# EAGLE design SmallTime-v02 (EAGLE 6.3)
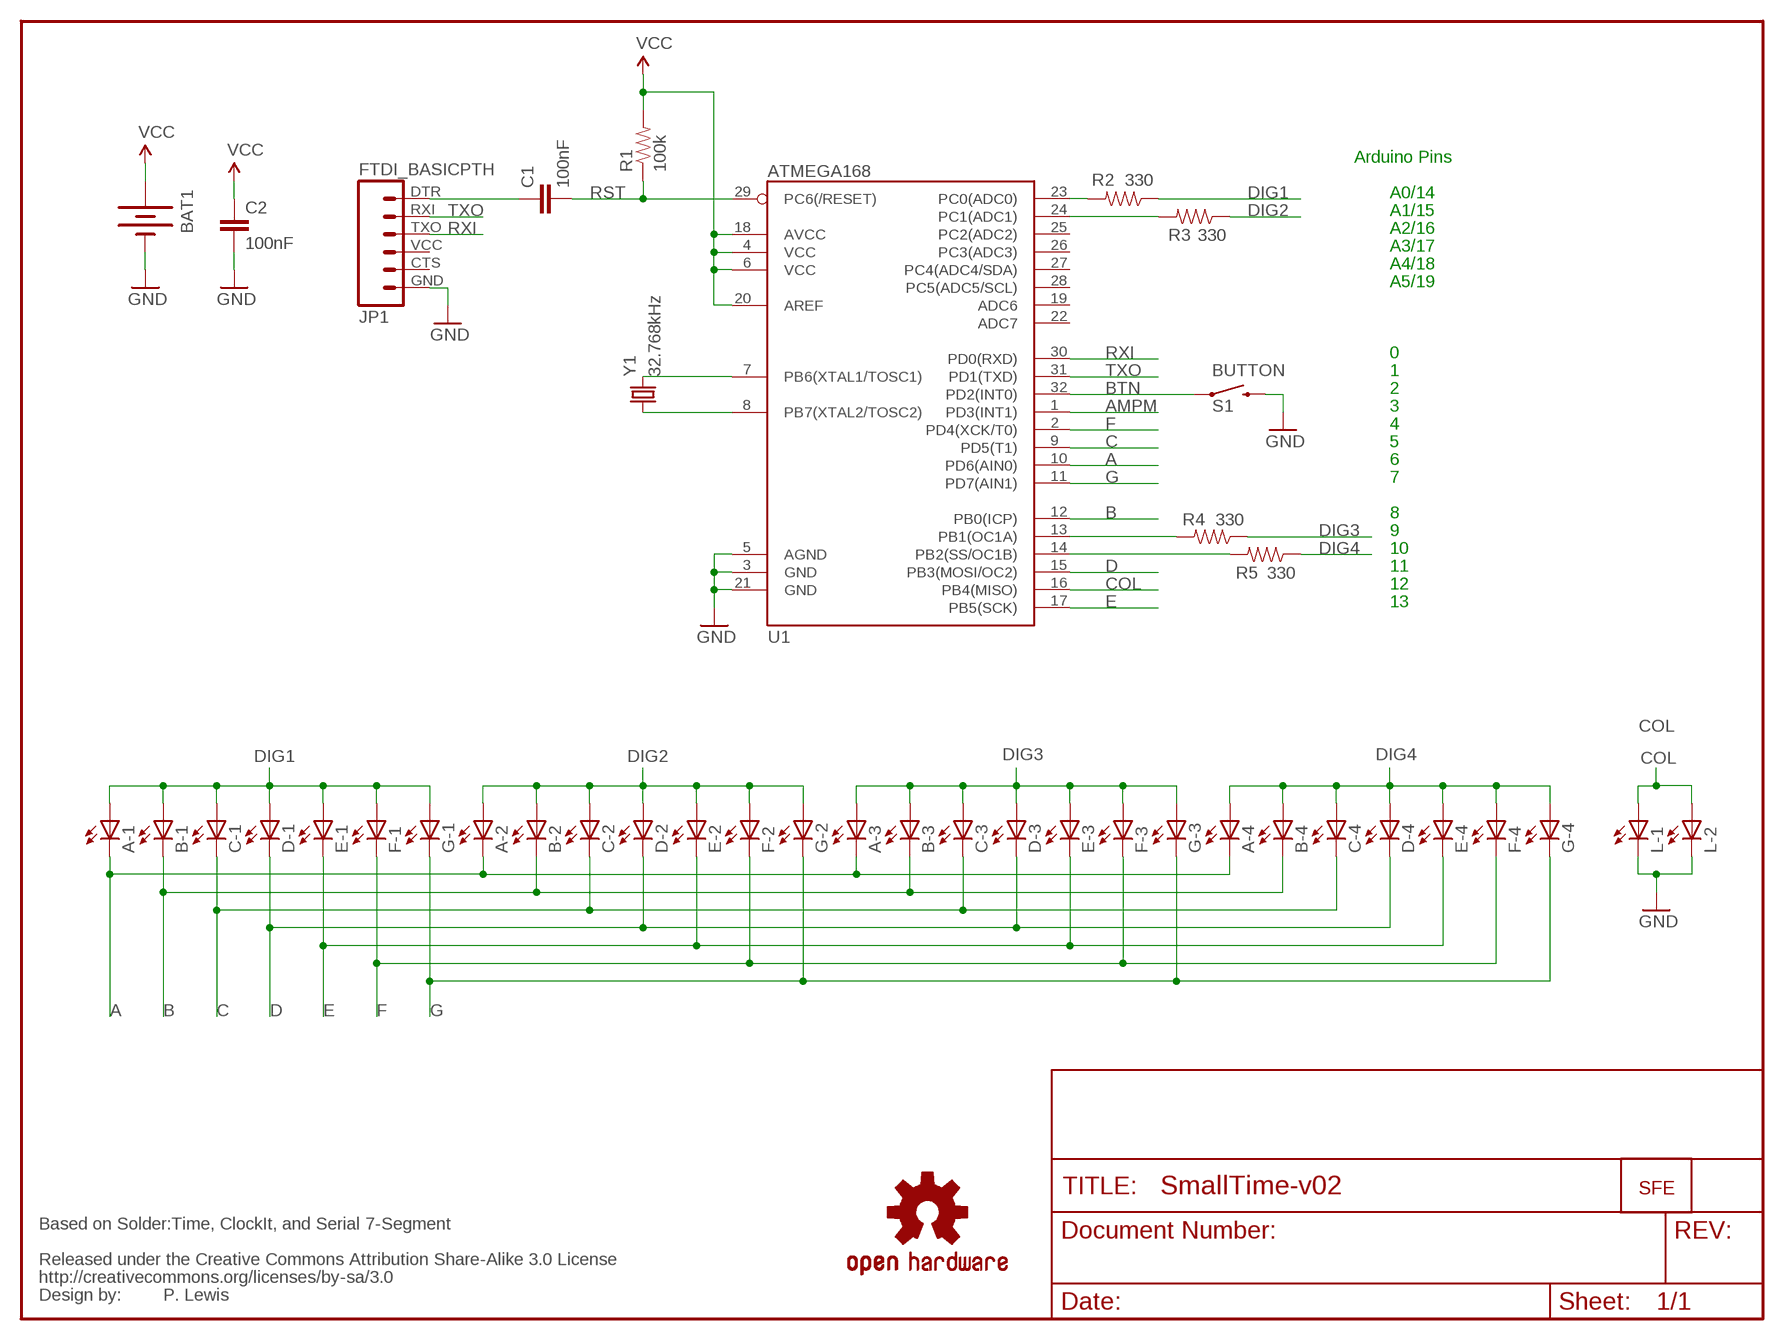
[diagram p0: schematic, sheet 1]

## Parts
A-1  LEDBOTTOM  [LED-1206-BOTTOM-TINGHT]
A-2  LEDBOTTOM  [LED-1206-BOTTOM-TINGHT]
A-3  LEDBOTTOM  [LED-1206-BOTTOM-TINGHT]
A-4  LEDBOTTOM  [LED-1206-BOTTOM-TINGHT]
B-1  LEDBOTTOM  [LED-1206-BOTTOM-TINGHT]
B-2  LEDBOTTOM  [LED-1206-BOTTOM-TINGHT]
B-3  LEDBOTTOM  [LED-1206-BOTTOM-TINGHT]
B-4  LEDBOTTOM  [LED-1206-BOTTOM-TINGHT]
BAT1  BATTERYFOB  [BATTERY_20MM_PTH_COMPACT]
C1  100nF  CAP0603-CAP  [0603-CAP]
C2  100nF  CAP0603-CAP  [0603-CAP]
C-1  LEDBOTTOM  [LED-1206-BOTTOM-TINGHT]
C-2  LEDBOTTOM  [LED-1206-BOTTOM-TINGHT]
C-3  LEDBOTTOM  [LED-1206-BOTTOM-TINGHT]
C-4  LEDBOTTOM  [LED-1206-BOTTOM-TINGHT]
D-1  LEDBOTTOM  [LED-1206-BOTTOM-TINGHT]
D-2  LEDBOTTOM  [LED-1206-BOTTOM-TINGHT]
D-3  LEDBOTTOM  [LED-1206-BOTTOM-TINGHT]
D-4  LEDBOTTOM  [LED-1206-BOTTOM-TINGHT]
E-1  LEDBOTTOM  [LED-1206-BOTTOM-TINGHT]
E-2  LEDBOTTOM  [LED-1206-BOTTOM-TINGHT]
E-3  LEDBOTTOM  [LED-1206-BOTTOM-TINGHT]
E-4  LEDBOTTOM  [LED-1206-BOTTOM-TINGHT]
F-1  LEDBOTTOM  [LED-1206-BOTTOM-TINGHT]
F-2  LEDBOTTOM  [LED-1206-BOTTOM-TINGHT]
F-3  LEDBOTTOM  [LED-1206-BOTTOM-TINGHT]
F-4  LEDBOTTOM  [LED-1206-BOTTOM-TINGHT]
G-1  LEDBOTTOM  [LED-1206-BOTTOM-TINGHT]
G-2  LEDBOTTOM  [LED-1206-BOTTOM-TINGHT]
G-3  LEDBOTTOM  [LED-1206-BOTTOM-TINGHT]
G-4  LEDBOTTOM  [LED-1206-BOTTOM-TINGHT]
JP1  FTDI_BASICPTH  [FTDI_BASIC]
L-1  LEDBOTTOM  [LED-1206-BOTTOM-TINGHT]
L-2  LEDBOTTOM  [LED-1206-BOTTOM-TINGHT]
R1  100k  RESISTOR0603-RES  [0603-RES]
R2  330  RESISTOR0603-RES  [0603-RES]
R3  330  RESISTOR0603-RES  [0603-RES]
R4  330  RESISTOR0603-RES  [0603-RES]
R5  330  RESISTOR0603-RES  [0603-RES]
S1  BUTTON  SWITCH-MOMENTARY-2SIDE_EZ  [TACTILE-PTH-SIDEEZ]
U1  ATMEGA168  [TQFP32-08]
U$2  CREATIVE_COMMONS  [CREATIVE_COMMONS]
U$4  OSHW-LOGOS  [OSHW-LOGO-S]
U$5  LOGO-SFENW2  [SFE-NEW-WEB]
Y1  32.768kHz  CRYSTALTC26H_EZ  [TC26HEZ]

## Nets
A: A-1.C A-2.C A-3.C A-4.C U1.10(PD6(AIN0))
AMPM: U1.1(PD3(INT1))
B: B-1.C B-2.C B-3.C B-4.C U1.12(PB0(ICP))
BTN: S1.1 U1.32(PD2(INT0))
C: C-1.C C-2.C C-3.C C-4.C U1.9(PD5(T1))
COL: L-1.A L-2.A U1.16(PB4(MISO))
D: D-1.C D-2.C D-3.C D-4.C U1.15(PB3(MOSI/OC2))
DIG1: A-1.A B-1.A C-1.A D-1.A E-1.A F-1.A G-1.A R2.1
DIG2: A-2.A B-2.A C-2.A D-2.A E-2.A F-2.A G-2.A R3.1
DIG3: A-3.A B-3.A C-3.A D-3.A E-3.A F-3.A G-3.A R4.1
DIG4: A-4.A B-4.A C-4.A D-4.A E-4.A F-4.A G-4.A R5.1
E: E-1.C E-2.C E-3.C E-4.C U1.17(PB5(SCK))
F: F-1.C F-2.C F-3.C F-4.C U1.2(PD4(XCK/T0))
G: G-1.C G-2.C G-3.C G-4.C U1.11(PD7(AIN1))
GND: BAT1.2(-) C2.2 JP1.GND L-1.C L-2.C S1.2 U1.3(GND) U1.5(AGND) U1.21(GND)
N$1: U1.8(PB7(XTAL2/TOSC2)) Y1.1
N$2: U1.7(PB6(XTAL1/TOSC1)) Y1.2
N$3: C1.1 JP1.DTR
N$4: R4.2 U1.13(PB1(OC1A))
N$5: R5.2 U1.14(PB2(SS/OC1B))
N$6: R3.2 U1.24(PC1(ADC1))
N$7: R2.2 U1.23(PC0(ADC0))
RST: C1.2 R1.1 U1.29(PC6(/RESET))
RXI: JP1.TXO U1.30(PD0(RXD))
TXO: JP1.RXI U1.31(PD1(TXD))
VCC: BAT1.1(+) C2.1 R1.2 U1.4(VCC) U1.6(VCC) U1.18(AVCC) U1.20(AREF)
Unconnected: JP1.CTS JP1.VCC U1.19(ADC6) U1.22(ADC7) U1.25(PC2(ADC2)) U1.26(PC3(ADC3)) U1.27(PC4(ADC4/SDA)) U1.28(PC5(ADC5/SCL))

## Notes on the sheet
- Arduino Pins
- A0/14
- A1/15
- A2/16
- A3/17
- A4/18
- A5/19
- 0
- 1
- 2
- 3
- 4
- 5
- 6
- 7
- 8
- 9
- 10
- 11
- 12
- 13
- COL
- Based on Solder:Time, ClockIt, and Serial 7-Segment
- P. Lewis

## Library data of the parts
A-1-A-4 B-1-B-4 C-1-C-4 D-1-D-4 E-1-E-4 F-1-F-4 G-1-G-4 L-1 L-2 = Testing:LED: LEDs Standard schematic elements and footprints for 5mm, 3mm, 1206, and 0603 sized LEDs. 5mm - Spark Fun Electronics SKU : COM-00529 (and others)
BAT1 = SparkFun:BATTERY: Battery Holders Various common sizes : AA, AAA, 20mm coin cell and 12mm coin cell.
C1 C2 = SparkFun-Passives:CAP: Capacitor Standard 0603 ceramic capacitor, and 0.1" leaded capacitor.
JP1 = SparkFun:FTDI_BASIC: FTDI Basic: 3.3V and 5V
R1-R5 = SparkFun-Passives:RESISTOR: Resistor Basic schematic elements and footprints for 0603, 1206, and PTH resistors.
S1 = SparkFun-Electromechanical:SWITCH-MOMENTARY-2: Various NO switches- pushbuttons, reed, etc
U1 = SparkFun:ATMEGA168
U$2 = SparkFun:CREATIVE_COMMONS
U$4 = SparkFun:OSHW-LOGO: Open Source Hardware Logo This logo indicates the piece of hardware it is found on incorporates a OSHW license and/or adheres to the definition of open source hardware found here: http://freedomdefined.org/OSHW
U$5 = SparkFun:LOGO-SFE: Spark Fun Electronics PCB Logo This is the standard Spark Fun Electronics PCB logo.
Y1 = SparkFun-FreqCtrl:CRYSTAL: Various standard crystals. Proven footprints. Spark Fun Electronics SKU : COM-00534

## Board
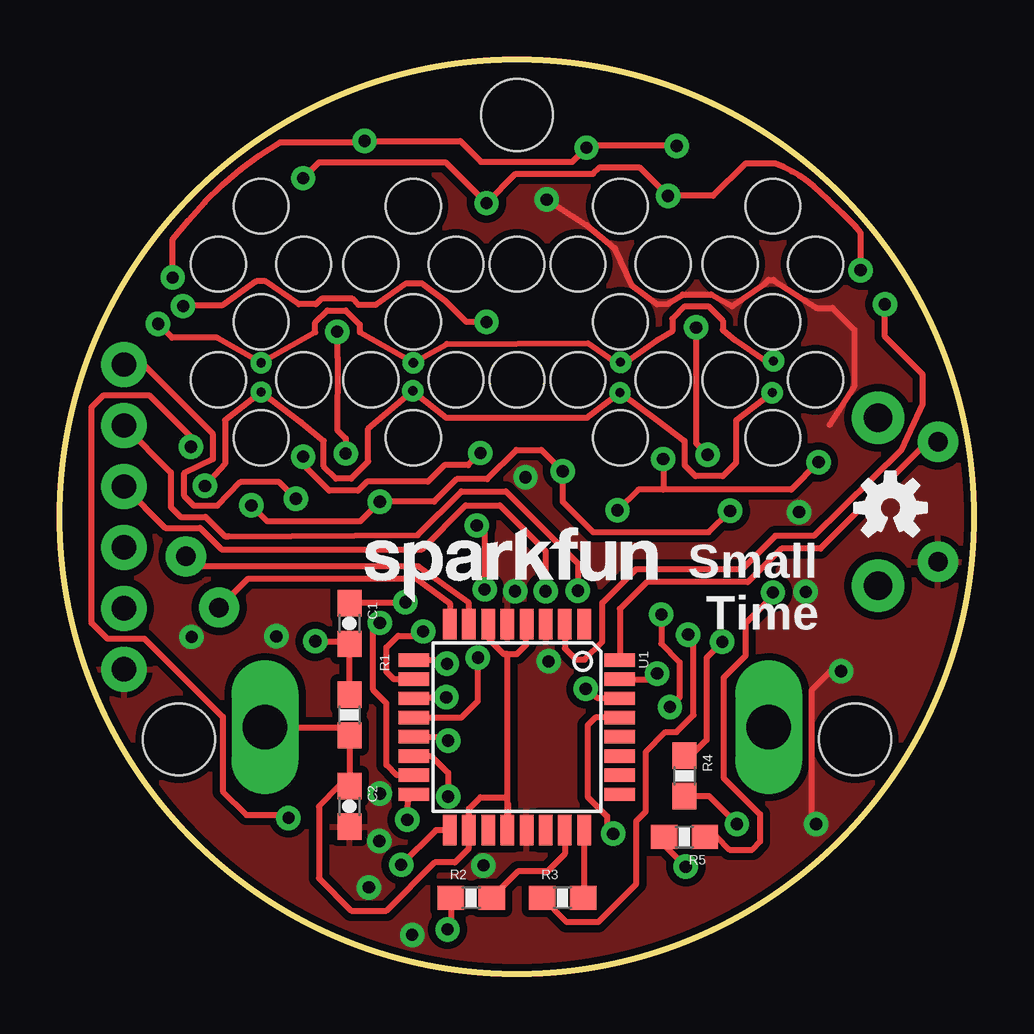
[diagram p1: board, top side]
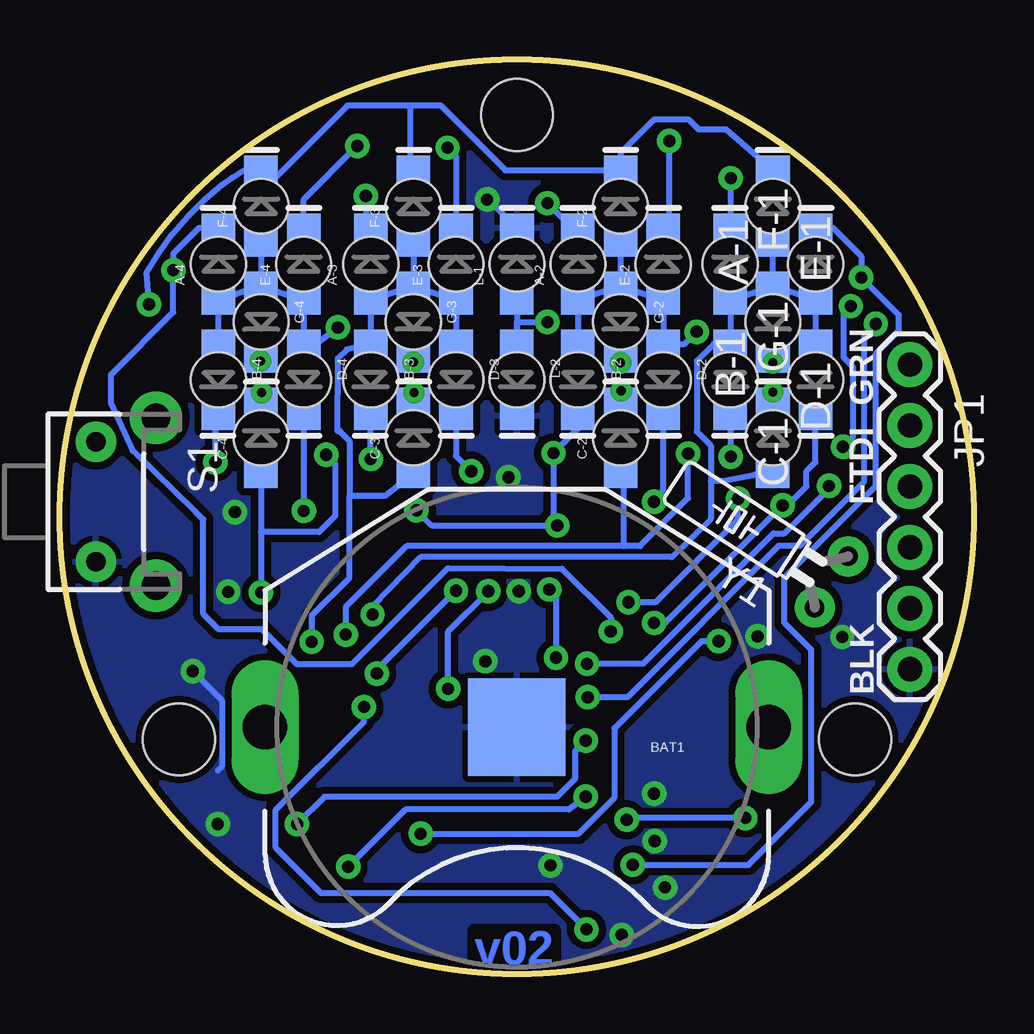
[diagram p2: board, bottom side, seen from below]

Size 38.1 x 38.1 mm. Coordinates in mm from the lower left corner, seen from the top.
Outline: circle at 19.05,19.05 radius 19.05
Copper layers (1*16): Top 0.035mm / dielectric 1.5mm / Bottom 0.035mm
Design rules "SparkFun": minimum track width 8mil, minimum drill 20mil, track to track 8mil, track to pad 8mil, pad to pad 8mil, via to via 8mil, smd to smd 8mil, copper to edge 8mil, drill to drill 8mil, minimum pad ring 12mil, minimum via ring 10mil, stop-mask expansion 4mil, vias tented up to drill 20mil, thermal gap 10mil
Holes 3 mm at 19.05,35.81 4.95,9.78 33.15,9.78

### Footprints (pad centres in the part's own frame; a part is rotated, then mirrored left to right if it is on the bottom)
LED-1206-BOTTOM-TINGHT = smd 1.2 x 1.397: A -1.5,0 | smd 1.2 x 1.4: C 1.5,0 | hole 2.286: 0,0
BATTERY_20MM_PTH_COMPACT = drill 1.854 long: 1 -10.5,0; 3 10.5,0 | smd 4.064 x 4.064: 2 0,0
0603-CAP = smd 1.1 x 1: 1 -0.85,0; 2 0.85,0
FTDI_BASIC = drill 1.016 pad 1.88: CTS 10.16,0; DTR 0,0; GND 12.7,0; RXI 2.54,0; TXO 5.08,0; VCC 7.62,0
0603-RES = smd 1.1 x 1: 1 -0.85,0; 2 0.85,0
TACTILE-PTH-SIDEEZ = drill 0.8 pad 1.7: 1 -2.5,0; 2 2.5,0 | drill 1.2 pad 2.2: ANCHOR1 -3.5,2.5; ANCHOR2 3.5,2.5
TQFP32-08 = smd 1.27 x 0.559: 1 -4.293,2.8; 2 -4.293,2; 3 -4.293,1.2; 4 -4.293,0.4; 5 -4.293,-0.4; 6 -4.293,-1.2; 7 -4.293,-2; 8 -4.293,-2.8; 17 4.293,-2.8; 18 4.293,-2; 19 4.293,-1.2; 20 4.293,-0.4; 21 4.293,0.4; 22 4.293,1.2; 23 4.293,2; 24 4.293,2.8 | smd 0.559 x 1.27: 9 -2.8,-4.293; 10 -2,-4.293; 11 -1.2,-4.293; 12 -0.4,-4.293; 13 0.4,-4.293; 14 1.2,-4.293; 15 2,-4.293; 16 2.8,-4.293; 25 2.8,4.293; 26 2,4.293; 27 1.2,4.293; 28 0.4,4.293; 29 -0.4,4.293; 30 -1.2,4.293; 31 -2,4.293; 32 -2.8,4.293
TC26HEZ = drill 0.813 pad 1.676: 1 -1.27,0; 2 1.27,0

### Placement (x,y rotation side)
A-1  10.16,29.59 90 bottom
A-2  16.51,29.59 90 bottom
A-3  25.15,29.59 90 bottom
A-4  31.5,29.59 90 bottom
B-1  10.16,24.77 270 bottom
B-2  16.51,24.77 270 bottom
B-3  25.15,24.77 270 bottom
B-4  31.5,24.77 270 bottom
BAT1  19.05,10.29 180 bottom
C1  12.07,14.61 270 top
C2  12.07,6.99 270 top
C-1  8.38,22.35 90 bottom
C-2  14.73,22.35 90 bottom
C-3  23.37,22.35 90 bottom
C-4  29.72,22.35 90 bottom
D-1  6.6,24.77 270 bottom
D-2  12.95,24.77 270 bottom
D-3  21.59,24.77 270 bottom
D-4  27.94,24.77 270 bottom
E-1  6.6,29.59 90 bottom
E-2  12.95,29.59 90 bottom
E-3  21.59,29.59 90 bottom
E-4  27.94,29.59 90 bottom
F-1  8.38,32 90 bottom
F-2  14.73,32 90 bottom
F-3  23.37,32 90 bottom
F-4  29.72,32 90 bottom
G-1  8.38,27.18 270 bottom
G-2  14.73,27.18 270 bottom
G-3  23.37,27.18 270 bottom
G-4  29.72,27.18 270 bottom
JP1  2.67,25.4 270 bottom
L-1  19.05,29.59 90 bottom
L-2  19.05,24.77 270 bottom
R1  12.07,10.8 270 top
R2  17.15,3.18 0 top
R3  20.96,3.18 0 top
R4  26.04,8.26 270 top
R5  26.04,5.72 180 top
S1  36.6,19.68 270 bottom
U1  19.05,10.29 270 top
U$2  -3.17,-9.52 0 top  (outside the outline)
U$4  34.62,19.43 0 top
U$5  12.7,15.49 0 top
Y1  5.94,16.34 57 bottom

### Tracks (layer width: path | path; a pad name or v marks a point on that pad's centre or on a via)
A  (via drill 0.51)
  Top 0.254: v15.14,14.28 14.96,14.1 14.1,14.1 13.61,13.61 13.61,12.6 13.93,12.29 U1.10 | v10.14,33.17 10.8,33.83 16.08,33.83 v17.78,32.13 19,33.35 22.23,33.35 22.5,33.63 24.16,33.63 v25.35,32.44 27.23,32.44 28.58,33.78 29.82,33.78 arc-19 31.45,32.82 arc-6 33.15,31.17 33.38,30.89 v33.38,29.34
  Bottom 0.254: v25.35,32.44 25.35,31.29 A-3.C | A-1.C 10.16,31.24 10.14,31.27 v10.14,33.17 | A-4.C 32.31,31.09 33.38,30.03 v33.38,29.34 33.38,27.58 35.97,24.99 35.97,23.77 35.08,21.82 32.46,19.28 32.13,18.95 32.13,15.01 31.5,14.38 29.69,14.38 28.22,12.9 25.93,12.9 21.92,16.92 17.17,16.89 15.14,14.86 v15.14,14.28 | A-2.C 16.74,31.09 v17.78,32.13
B  (via drill 0.51)
  Top 0.254: v31.62,21.34 30.48,20.19 25.15,20.19 | v17.53,21.72 17.02,21.21 16.03,21.21 15.34,20.52 12.8,20.52 12.42,20.14 11.23,20.14 10.14,21.23 v10.14,21.57 | U1.12 16.73,10.69 17.42,11.38 v17.42,13.18 | v17.37,18.69 17.7,18.36 v17.7,16.03 | v25.15,21.46 25.15,20.19 | 25.15,20.19 24.11,20.19 v23.24,19.33
  Bottom 0.254: B-4.C 31.62,23.14 v31.62,21.34 | v25.15,21.46 B-3.C | B-1.C 10.16,21.46 10.14,21.49 v10.14,21.57 | B-2.C 16.51,22.73 v17.53,21.72 17.53,18.85 v17.37,18.69 22.61,18.69 v23.24,19.33 | v17.7,16.03 17.42,15.75 v17.42,13.18
BTN
  Top 0.254: U1.32 23.34,15.22 24.46,16.33 28.68,16.33 30.07,17.73 31.7,17.73 36.15,22.18 S1.1
C  (via drill 0.38, 0.51)
  Top 0.254: v29.69,24.23 28.19,23.09 28.19,21.31 27.64,20.75 26.49,20.75 26.04,21.21 26.04,22.23 24.89,23.09 v23.34,24.23 21.97,23.19 16.1,23.19 v14.71,24.31 12.85,22.73 12.85,21.36 12.14,20.65 11.51,20.65 11,21.16 11,22.23 10.06,22.99 v8.38,24.26 6.88,23.09 6.88,21.26 v6.05,20.35 | U1.9 15.97,13.09 v16.13,12.93
  Bottom 0.254: C-1.C v8.38,24.26 | v14.71,24.31 C-2.C | v29.69,24.23 C-4.C | v23.34,24.23 C-3.C | v16.13,12.93 13.79,12.93 8.36,18.36 7.9,18.36 6.05,20.22 v6.05,20.35
COL  (via drill 0.51)
  Top 0.254: v17.78,27.18 16.94,27.18 16.08,28.04 15.09,28.78 14.43,28.78 13.16,27.89 12.45,27.89 12.19,28.14 10.9,28.14 10.67,27.92 9.96,27.92 8.56,28.88 8.18,28.88 6.76,27.86 5.28,27.86 v5.13,27.84 | v9.53,6.5 9.4,6.63 7.77,6.63 6.78,7.62 6.78,10.72 3.53,13.97 1.98,13.97 1.32,14.63 1.32,23.62 1.83,24.13 3.71,24.13 5.46,22.38 v5.46,21.97 | v14.48,6.43 14.5,7.23 U1.16
  Bottom 0.254: L-1.A L-2.A 19.05,27.18 v17.78,27.18 | v5.13,27.84 5.44,27.71 5.44,25.71 5.06,25.32 5.06,22.38 v5.46,21.97 | v9.53,6.5 14.4,6.5 v14.48,6.43
D  (via drill 0.51)
  Top 0.254: v27.94,19.3 27.05,18.42 22.23,18.42 20.96,19.69 v20.96,20.96 20.07,21.84 19.03,21.84 17.81,20.63 16.54,20.63 15.6,19.69 v13.34,19.69 12.52,18.87 8.64,18.87 v7.98,19.53 | v13.34,14.63 13.06,14.28 13.06,11.84 13.61,11.28 13.61,8.71 14.04,8.29 U1.15
  Bottom 0.254: 6.76,23.27 D-1.C 6.6,21.34 6.99,20.96 6.99,20.32 7.77,19.53 v7.98,19.53 12.88,14.63 v13.34,14.63 | v13.34,19.69 12.95,20.19 D-2.C | D-3.C 21.59,21.59 v20.96,20.96 | D-4.C v27.94,19.3
DIG1  (via drill 0.51)
  Top 0.254: R2.1 16.3,2 v16.15,1.85 | v25.07,14.99 25.07,13.77 25.83,13.01 25.83,11.53 v25.43,11.13
  Bottom 0.254: G-1.A E-1.A D-1.A | G-1.A F-1.A | G-1.A A-1.A B-1.A 10.84,26.27 11.56,25.55 11.56,22.61 10.97,22.02 10.97,20.55 | 8.38,21.11 C-1.A 8.54,21.11 9.12,20.83 10.52,20.55 10.97,20.55 | v25.07,14.99 25.07,15.32 23.06,17.37 12.6,17.37 11.8,18.14 10.97,18.97 10.97,20.55 | v25.43,11.13 25.43,10.52 29.11,6.83 29.11,5.26 27.23,3.38 17.68,3.38 v16.15,1.85
DIG2  (via drill 0.51)
  Top 0.254: v11.91,21.69 11.91,22.33 11.56,22.68 11.58,25.68 11.58,26.75 v11.56,26.77 | R3.1 21.12,2.16 22.43,2.16 24.03,3.76 24.03,6.38 24.41,6.76 24.41,9.25 25.25,10.08 25.71,10.08 26.42,10.8 26.42,13.92 v26.19,14.15
  Bottom 0.254: F-2.A G-2.A | G-2.A E-2.A D-2.A 12.06,26.27 v11.56,26.77 | G-2.A A-2.A B-2.A | 14.78,21.06 C-2.A 14.61,20.98 14.61,17.83 | 14.61,17.83 13.92,17.83 11.91,19.84 v11.91,21.69 | 14.61,17.83 23.65,17.83 26.19,15.29 v26.19,14.15
DIG3  (via drill 0.51)
  Top 0.254: R4.1 26.3,9.11 26.95,9.75 26.95,13.18 v27.61,13.84
  Bottom 0.254: F-3.A G-3.A | G-3.A A-3.A B-3.A 26.14,26.04 26.52,25.65 26.54,22.63 26.44,22.63 26.04,22.23 26.04,19.94 | G-3.A E-3.A D-3.A | 23.42,21.16 C-3.A 24.54,19.94 26.04,19.94 | 26.04,19.94 26.04,16.51 27.61,14.94 v27.61,13.84
DIG4  (via drill 0.51)
  Top 0.254: v26.52,26.95 26.52,22.12 v27,21.64 | R5.1 27.38,5.72 27.92,5.18 28.85,5.18 29.19,5.51 29.19,6.66 27.66,8.18 27.66,12.34 28.58,13.26 28.58,14.61 29.72,15.75 v29.72,15.9
  Bottom 0.254: F-4.A G-4.A | G-4.A A-4.A B-4.A | G-4.A E-4.A 27.94,26.77 27.43,26.27 | D-4.A 27.43,26.27 | 27.43,26.27 v26.52,26.95 | v27,21.64 26.62,21.26 26.62,19.1 27.31,18.42 29.72,18.42 | C-4.A 29.72,18.42 | 29.72,18.42 v29.72,15.9
E  (via drill 0.51)
  Top 0.254: v25.71,34.52 22.02,34.52 v21.95,34.44 21.36,33.86 17.55,33.86 16.69,34.72 v12.7,34.72 12.7,34.67 9.17,34.67 arc19 5.36,31.42 4.7,30.63 v4.7,29.03 | U1.17 15.67,5.99 v14.22,4.55
  Bottom 0.254: E-4.C 27.94,32.28 v25.71,34.52 | v21.95,34.44 21.59,34.09 E-3.C | E-2.C 12.7,31.35 v12.7,34.72 | E-1.C 5.87,31.09 4.7,29.92 v4.7,29.03 3.12,27.46 3.12,26.82 4.09,25.86 4.09,20.35 7.9,16.54 7.9,14.63 6.78,13.51 6.78,7.16 9.4,4.55 v14.22,4.55
F  (via drill 0.51)
  Top 0.254: U1.2 21.05,13.57 21.51,13.11 21.87,13.11 22.61,13.84 22.61,15.47 24,16.87 28.42,16.87 29.82,18.26 31.42,18.26 35.08,21.84 35.97,23.77 35.97,24.99 34.39,26.57 v34.39,27.92
  Bottom 0.254: v34.39,27.92 34.49,29.24 arc22 31.32,32.92 arc7 30.12,33.68 29.95,33.5 F-4.C 29.06,33.25 26.11,36.2 23.5,36.2 | F-3.C 23.5,33.38 23.5,36.2 | 23.5,36.2 22.23,36.2 19.53,33.5 F-2.C 14.73,34.21 13.34,35.61 11.89,35.61 11.48,35.2 10.34,35.2 F-1.C
G  (via drill 0.38, 0.51)
  Top 0.254: v29.74,25.55 29.41,25.55 28.14,26.42 27.64,26.85 27.64,27.23 27.03,27.84 26.06,27.84 25.53,27.31 25.53,26.8 24.92,26.44 23.6,25.5 v23.37,25.5 23.11,25.5 23.09,25.53 22,26.29 16.13,26.26 v14.73,25.48 12.5,26.75 12.5,27.08 11.91,27.66 11.15,27.66 10.64,27.15 10.64,26.75 v8.38,25.48 6.55,26.52 4.67,26.52 v4.09,27.1 | U1.11 14.8,11.53 v16.1,11.53
  Bottom 0.254: G-4.C v29.74,25.55 | G-3.C v23.37,25.5 | v14.73,25.48 G-2.C | v8.38,25.48 G-1.C | v16.1,11.53 14.45,11.53 8.13,17.86 7.24,17.86 4.57,20.52 4.57,26.62 v4.09,27.1
GND  (via drill 0.51)
  Top 0.254: v20.3,32.28 21.95,31.22 23.14,30.23 23.85,28.7 24.89,27.92 25.35,27.94 25.96,28.32 27.15,28.32 28.02,27.84 29.39,28.78 29.54,28.93 29.74,28.93 31.55,27.76 32.21,27.76 33.12,26.85 33.12,24.51 32.08,22.89 | v31.52,6.25 31.34,6.43 31.34,11.84 32.13,12.62 v32.56,12.62
  Bottom 0.254: L-1.C 20.24,32.28 v20.3,32.28 | v32.56,12.62 31.34,11.41 31.34,8.66 31.52,8.48
  other vias: 19.41,20.7 31.09,15.93 13.31,5.54 9.02,14.07 5.49,14.05 30.81,19.25 20.37,13.03 12.88,3.61 17.65,4.52 13.34,7.52 18.97,15.95 14.68,1.63
  pour Bottom (isolate 0.305): -0.63,-0.63 -0.63,38.73 38.73,38.73 38.73,-0.63
  pour Top (isolate 0.305): -0.63,-0.63 -0.63,38.73 38.73,38.73 38.73,-0.63
N$1
  Top 0.254: U1.8 16.25,15.45 14.83,16.49 7.84,16.49 Y1.1
N$2
  Top 0.254: U1.7 17.05,15.46 14.94,16.99 5.66,16.99 Y1.2
N$3  (via drill 0.51)
  Top 0.254: JP1.DTR 3.48,25.4 6.38,22.5 6.38,21.46 5.18,20.88 5.18,19.91 5.59,19.51 6.55,19.51 7.52,20.5 9.14,20.5 v9.83,19.81 | C1.1 12.1,15.49 v14.4,15.49
  Bottom 0.254: v14.4,15.49 13.28,15.49 9.83,18.95 v9.83,19.81
N$4  (via drill 0.51)
  Top 0.254: 14.78,9.91 U1.13 16.02,9.89 v16.18,9.73 | v28.22,6.25 27.06,7.41 R4.2
  Bottom 0.254: v28.22,6.25 27.08,7.39 17.37,7.39 16.61,8.15 16.61,9.3 v16.18,9.73
N$5  (via drill 0.51)
  Top 0.254: U1.14 15.48,9.09 16.18,8.38 v16.18,7.39 | R5.2 25.19,5.37 v26.09,4.47
  Bottom 0.254: v16.18,7.39 16.89,6.86 23.7,6.86 v26.09,4.47
N$6
  Top 0.254: U1.24 21.85,3.22 R3.2
N$7
  Top 0.254: U1.23 21.05,5 20.32,4.27 19.09,4.27 R2.2
RST  (via drill 0.51)
  Top 0.254: R1.1 C1.2 11.95,13.87 v10.64,13.87 | U1.29 22.32,10.69 22,10.36 22,7.39 22.81,6.58 22.81,6.1 v23.06,5.84
  Bottom 0.254: v23.06,5.84 16.49,5.84 14.99,7.34 14.99,10.24 11.35,13.87 v10.64,13.87
RXI  (via drill 0.51)
  Top 0.254: JP1.TXO 4.39,18.59 5.84,18.59 6.73,17.7 15.09,17.7 16.92,19.53 18.34,19.53 20.24,17.63 v20.24,15.95 | U1.30 22.42,11.49 v21.92,11.89
  Bottom 0.254: v21.92,11.89 21.92,14.28 v20.24,15.95
TXO  (via drill 0.51)
  Top 0.254: JP1.RXI 4.62,20.9 4.62,19.46 5.03,19.05 6.07,19.05 6.88,18.24 6.99,18.24 7.04,18.24 14.91,18.29 16.74,20.12 18.59,20.12 21.59,17.12 v21.59,15.98 | U1.31 24.66,12.29 v24.89,12.52
  Bottom 0.254: v21.59,15.98 24.89,12.68 v24.89,12.52
VCC
  Top 0.254: BAT1.1 11.72,10.29 R1.2 C2.1 11.65,7.84 10.8,6.99 10.8,3.99 12.14,2.64 13.61,2.64 15.62,4.65 16.46,4.65 17.05,5.24 U1.18 17.05,6.89 17.53,7.37 18.65,7.37 | 18.67,7.11 18.67,6.01 U1.20 18.65,7.37 | 18.65,7.37 18.65,13.34 | U1.6 17.93,13.9 18.49,13.34 18.65,13.34 | 18.65,13.34 19.05,13.34 19.43,13.72 19.43,14.56 U1.4

### Text on the board
Bottom: v02
tPlace: Small | Time
bPlace: GRN | FTDI | BLK
Document: P. Lewis